# Altium schematic sheet Power.SchDoc
size A1; SheetNumber: 2; SheetTotal: 4
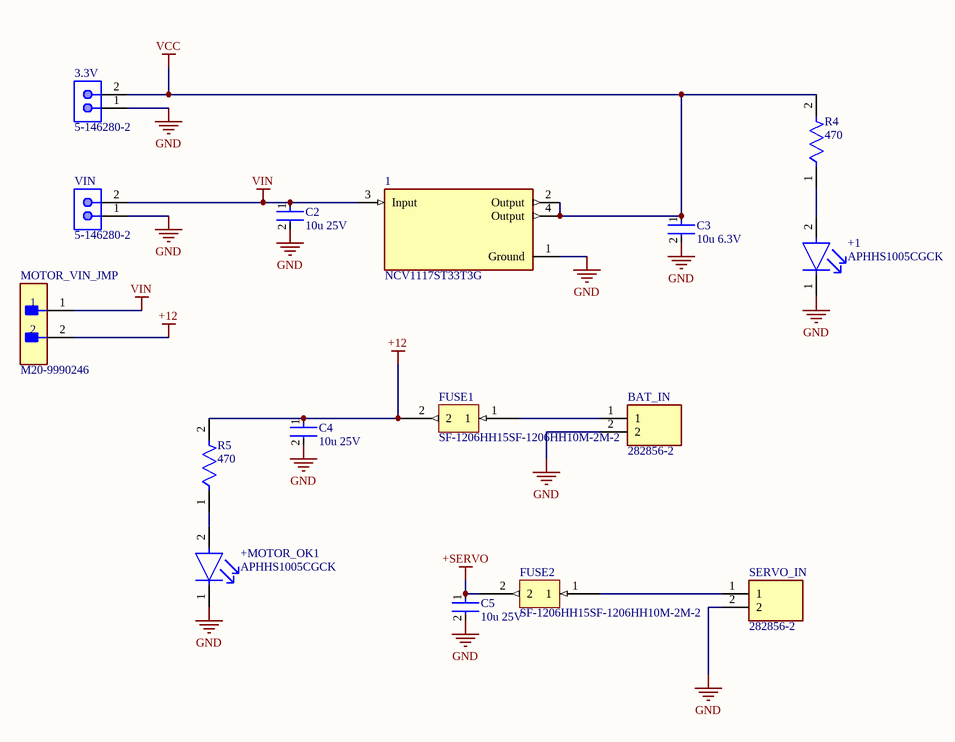
[diagram p0: Power.SchDoc]

## Parts
1  NCV1117ST33T3G  [FP-318H-MFG]
3.3V  5-146280-2  [TECO-5-146280-2_V]
+1  APHHS1005CGCK  [FP-APHHS1005CGCK-MFG]
+MOTOR_OK1  APHHS1005CGCK  [FP-APHHS1005CGCK-MFG]
BAT_IN  282856-2  [TE_282856-2]
C2  10u 25V  [FP-GRM21B-0_15-IPC_C]
C3  10u 6.3V  [FP-GRM155-0_05-MFG]
C4  10u 25V  [FP-GRM21B-0_15-IPC_C]
C5  10u 25V  [FP-GRM21B-0_15-IPC_C]
FUSE1  SF-1206HH15SF-1206HH10M-2M-2  [RESC3216X12N]
FUSE2  SF-1206HH15SF-1206HH10M-2M-2  [RESC3216X12N]
MOTOR_VIN_JMP  M20-9990246  [FP-M20-9990246-MFG]
R4  470  [FP-CRCW0402-e3-IPC_C]
R5  470  [FP-CRCW0402-e3-IPC_C]
SERVO_IN  282856-2  [TE_282856-2]
VIN  5-146280-2  [TECO-5-146280-2_V]

## Nets
+12: C4.1 FUSE1.2 MOTOR_VIN_JMP.2 R5.2
+SERVO: C5.1 FUSE2.2
GND: 1.1(Ground) 3.3V.1 +1.1(C) +MOTOR_OK1.1(C) BAT_IN.2 C2.2 C3.2 C4.2 C5.2 SERVO_IN.2 VIN.1
VCC: 1.2(Output) 1.4(Output) 3.3V.2 C3.1 R4.2
VIN: 1.3(Input) C2.1 MOTOR_VIN_JMP.1 VIN.2
Net+1_2: +1.2(A) R4.1
Net+MOTOR_OK1_2: +MOTOR_OK1.2(A) R5.1
NetBAT_IN_1: BAT_IN.1 FUSE1.1
NetFUSE2_1: FUSE2.1 SERVO_IN.1

## Library data of the parts
1 = CMP-07128-000021-1: IC REG LINEAR 3.3V 1A SOT223; Manufacturer: ON Semiconductor; Nominal Supply Current: 6mA; Min Supply Voltage: 2.4V; Number Of Outputs: 1; Standoff Height: 0.02mm; Automotive Grade: Grade 0; Accuracy Percentage: 1%; Max Junction Temp: +150°C; Output Type: Fixed; Dropout Voltage: 1.07V; Max Supply Voltage: 20V; Package: 318H; ComponentLink2Description: Datasheet; Output Current: 1A; Device Class L1: Integrated Circuits (ICs); Ambient Temperature Range Low: -40°C; Output Voltage: 3.3V; Octopart: https://octopart.com/ncv1117st33t3g-on+semiconductor-1215835; Manufacturer Part Number: NCV1117ST33T3G; Device Class L2: Power Management ICs; ComponentLink2URL: https://www.onsemi.com/pub/Collateral/NCP1117-D.PDF; Ipc Land Pattern Name: SOT230P700X180-4; Digikey Description: IC REG LINEAR 3.3V 1A SOT223; Height: 1.8mm; Ambient Temperature Range High: +125°C; Mouser Description: LDO Voltage Regulators 3.3V 1.0A Automotive; Category: IC; Temperature: -55°C to +150°C; Automotive: Yes; Temperature Range Low: -55°C; Temperature Range High: +150°C; Lead Free: Yes; Device Class L3: Voltage Regulators - Linear; RoHS: TRUE
3.3V VIN = CMP-2000-07492-1: Male Header, Pitch 2.54 mm, 1 x 2 Position, Height 8.21 mm, Tail Length 3.05 mm, -65 to 105 degC, RoHS, Bulk; Manufacturer: TE Connectivity; Mating Connector Lock: No(Without); Number of Positions: 2; Pitch: 2.54mm; PCB Mounting Orientation: Vertical; Keyed: No; Case\/Package: 100; Mating Post Length: 0.23inch; High Temperature Housing: Yes; Max Current Rating: 5A; PCB Thickness: 0.063inch; PCB Mount Retention: Without; Approvals: CSA; Current Rating: 3A; Radiation Hardening: No; Length: 4.67mm; Contact Mating Length: 0.23inch; Connector Type: Header; Number of Rows: 1; Termination Post Length: 0.12inch; Board Standoff: No(Without); Max Operating Temperature: 105degC; Contact Shape: Square; Selectively Loaded: No(Without); Gasket: No(Without); Number of Contacts: 2; Contact Gender: Male; Mating Alignment: No(Without); Manufacturer URL: http://www.te.com/; Datasheet URL: http://www.te.com/commerce/DocumentDelivery/DDEController?Action=showdoc&DocId=Customer+Drawing%7F146280%7FH1%7Fpdf%7FEnglish%7FENG_CD_146280_H1.pdf%7F5-146280-2; Mount: ThroughHole; Orientation: Straight; Packaging: Carton; Package Reference: 5-146280-2; Package Quantity: 500; Stabilizers: No(Without); Row Spacing: 2.54mm; Contact Material: CopperAlloy; Panel Mount Retention: No(Without); Datasheet Version: Rev. H1, 08/2016; Housing Colour: Black; Colour: Black; Package Description: Male Header, Pitch 2.54 mm, 1 x 2 Position, Height 8.21 mm, Tail Length 3.05 mm; Contact Plating: Matte; Housing Material: Polymer; Contact Protection: No(Without); Min Operating Temperature: -65degC; Mounting Technology: ThroughHole; Flammability Rating: UL94V-0; RoHSCompliant: true; Termination: ThroughHole; Depth: 2.34mm; High Speed Serial Data Connector: No
+1 +MOTOR_OK1 = CMP-44529-000044-1: LED GREEN CLEAR CHIP SMD; Viewing Angle: 120°; Dominant Wavelength: 570nm; Test Current: 20mA; Luminous Intensity: 50mcd; Forward Voltage: 2.1V; Number of LEDs: 1; Lens Color: Clear; Packaging: Tape and Reel; Max Operating Temperature: 85°C; Illumination Color: Green; Length: 1mm; Mount: Surface Mount; Lens Style: Clear; Color: Green; Number of Pins: 2; Wavelength: 570nm; Case/Package: 0402; Width: 0.5mm; Package Quantity: 2000; Case Code (Metric): 1005; Height: 0.6mm; Lead Free: Lead Free; Case Code (Imperial): 0402; Forward Current: 20mA; Min Operating Temperature: -40°C
BAT_IN SERVO_IN = CMP-036-000000-1: TERMI-BLOK PCB MOUNT 2P; MF: TE Connectivity; Design Item ID: 282856-2; Component Type: Standard; Package: None; Value: *; EU_RoHS_Compliance: Compliant with Exemptions; SnapEDA_Link: https://www.snapeda.com/parts/282856-2/TE%20Connectivity%20AMP%20Connectors/view-part/1809079/?ref=snap; Digi-Key_Purchase_URL: https://www.digikey.com/product-detail/en/te-connectivity-amp-connectors/1-282856-2/A98108-ND/1826971?utm_source=snapeda&utm_medium=aggregator&utm_campaign=symbol; Digi-Key_Part_Number: A98108-ND; TE_purchase_URL: https://www.te.com/usa-en/product-282856-2.html?te_bu=Cor&te_type=disp&te_campaign=seda_glo_cor-seda-global-disp-prtnr-fy19-seda-model-bom-cta_sma-317_1&elqCampaignId=32493; Pin Count: 2; MP: 282856-2; Source: SnapEDAsch.SchLib
C2 C4 C5 = CMP-2007-03541-2: Chip Multilayer Ceramic Capacitors for General Purpose, 0805, 10uF, X5R, 15%, 10%, 25V; Length: 2mm; Depth: 1.25mm; Termination: SMD/SMT; Voltage: 25V; Height: 1.25mm; Material: Ceramic; Thickness: 0.053inch; Radiation Hardening: No; Min Operating Temperature: -55°C; Width: 0.049inch; Package Quantity: 1; Mount: Surface Mount; Dielectric: X5R; Packaging: Tape and Reel; Capacitance: 10uF; Voltage Rating (DC): 25V; Lead Free: Lead Free; Max Operating Temperature: 85°C; Case Code (Imperial): 0805; Case/Package: 0805; Tolerance: 10%; Voltage Rating: 25V; Case Code (Metric): 2012
C3 = CMP-2008-04345-2: Chip Multilayer Ceramic Capacitors for General Purpose, 0402, 390pF, C0G, 30ppm/°C, 5%, 50V; REACH SVHC: No SVHC; Case Code (Metric): 1005; Thickness: 0.022inch; Lead Free: Lead Free; Case/Package: 0402; Min Operating Temperature: -55°C; Mount: Surface Mount; Length: 1mm; Depth: 0.5mm; Package Quantity: 1; Tolerance: 5%; Case Code (Imperial): 0402; Temperature Coefficient: 30ppm/°C; Packaging: Tape and Reel; Voltage Rating (DC): 50V; Material: Ceramic; Voltage Rating: 50V; Max Operating Temperature: 125°C; Voltage: 50V; Radiation Hardening: No; Capacitance: 390pF; Termination: SMD/SMT; Height: 0.5mm; Dielectric: C0G; Width: 0.02inch
FUSE1 FUSE2 = CMP-005-00013-1: Fuse Chip 10A 24VDC High Current and High Inrush Current Withstand 2-Pin SMD T/R
MOTOR_VIN_JMP = CMP-15831-000009-1: CONN HEADER VERT 2POS 2.54MM; Manufacturer: Harwin; Conn Gender: Male; Conn Orientation: Vertical; Number Of Contacts: 2; Current Rating: 3A; ComponentLink2URL: https://cdn.harwin.com/pdfs/M20-999.pdf; ComponentLink2Description: Datasheet; Package: M20-9990246; Temperature: -40°C to +105°C; Octopart: https://octopart.com/m20-9990246-harwin-2590635; Mouser Description: 2.54mm (0.1") Pitch SIL Vertical PC Tail Pin Header, 6.1mm mating pin height, tin, 2 contacts; Temperature Range High: +105°C; Device Class L1: Connectors; RoHS: TRUE; Automotive: No; Height: 8.99mm; Number Of Rows: 1; Contact Material: Tin,Nickel; Category: Conn; Pitch: 2.54mm; Lead Free: Yes; Digikey Description: CONN HEADER VERT 2POS 2.54MM; Manufacturer Part Number: M20-9990246; Temperature Range Low: -40°C; Device Class L3: unset; Device Class L2: Headers and Wire Housings
R4 R5 = CMP-2002-08122-2: RES Thick Film, 0Ω, 0.063W, 0402; Tolerance: 5%; Max Power Dissipation: 63mW; Voltage Rating: 50V; Temperature Coefficient: 100ppm/°C; Resistance: 0mR; Contact Plating: Tin; Height: 0.35mm; Radiation Hardening: No; Features: Automotive AEC-Q200; Composition: Thick Film; Width: 0.5mm; Weight: 2.3E-05oz; Termination: SMD/SMT; Packaging: Tape and Reel; Mount: Surface Mount; Case Code (Metric): 1005; Military Standard: Not; Min Operating Temperature: -55°C; Number of Terminations: 2; Package Quantity: 1; Case Code (Imperial): 0402; Depth: 0.5mm; Max Operating Temperature: 155°C; Case/Package: 0402; Power Rating: 63mW; Lead Free: Lead Free; Voltage Rating (DC): 50V; Length: 1mm